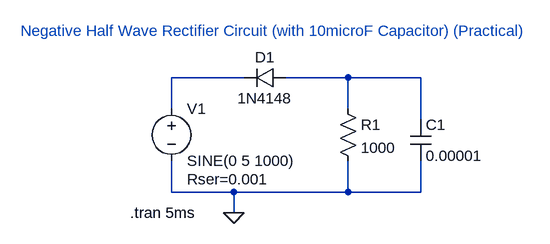
[diagram p0: schematic Assignment 3b (vi).asc]
Assignment 3b (vi).asc, the LTspice schematic file:
Version 4.1
SHEET 1 880 680
WIRE 320 80 208 80
WIRE 480 80 384 80
WIRE 592 80 480 80
WIRE 208 128 208 80
WIRE 480 128 480 80
WIRE 592 144 592 80
WIRE 208 256 208 208
WIRE 304 256 208 256
WIRE 480 256 480 208
WIRE 480 256 304 256
WIRE 592 256 592 208
WIRE 592 256 480 256
WIRE 304 288 304 256
FLAG 304 288 0
SYMBOL voltage 208 112 R0
WINDOW 123 0 0 Left 2
WINDOW 39 24 124 Left 2
SYMATTR SpiceLine Rser=0.001
SYMATTR InstName V1
SYMATTR Value SINE(0 5 1000)
SYMBOL res 464 112 R0
SYMATTR InstName R1
SYMATTR Value 1000
SYMBOL diode 384 64 R90
WINDOW 0 0 32 VBottom 2
WINDOW 3 32 32 VTop 2
SYMATTR InstName D1
SYMATTR Value 1N4148
SYMBOL cap 576 144 R0
SYMATTR InstName C1
SYMATTR Value 0.00001
TEXT 144 288 Left 2 !.tran 5ms
TEXT -24 8 Left 2 ;Negative Half Wave Rectifier Circuit (with 10microF Capacitor) (Practical)

The netlist it stands for:
* Assignment 3b (vi).asc
V1 N001 0 SINE(0 5 1000) Rser=0.001
R1 N002 0 1000
D1 N002 N001 1N4148
C1 N002 0 0.00001
.model D D
.lib standard.dio
.tran 5ms
* Negative Half Wave Rectifier Circuit (with 10microF Capacitor) (Practical)
.backanno
.end